# Altium project Controller PCB.PrjPcb
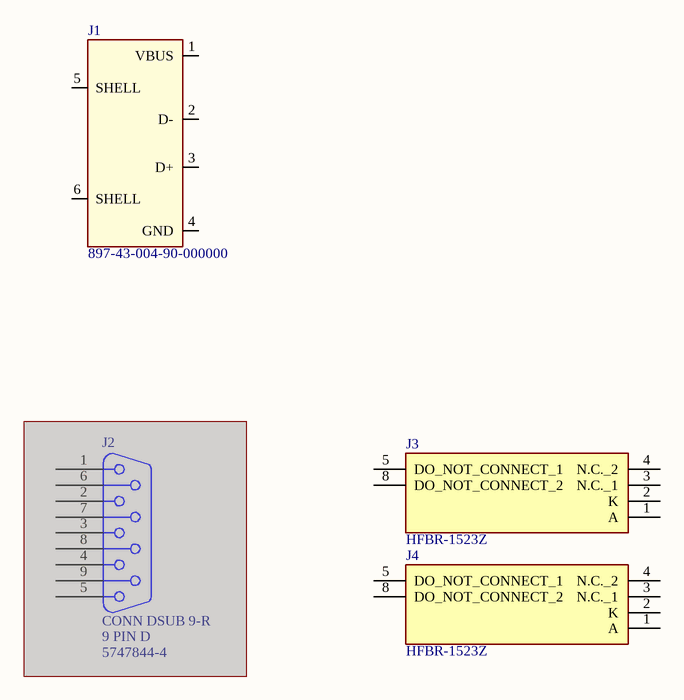
[diagram p0: Comms.SchDoc]
1 sheet, 4 parts. Net scope: global (net labels, ports and power ports of the same name join across sheets).
Board file: Controller PCB.PcbDoc

## Sheet Comms.SchDoc
size A; SheetNumber: 1; SheetTotal: 2

### Parts
J1  Manf P/N: 897-43-004-90-000000  [USB-R]  (hidden comment: USB-R)
J2  CONN DSUB 9-R  value 9 PIN D  Manf P/N: 5747844-4  [CONN9_5747844-4_TEC]  (masked out: inside a compile mask, not in the netlist)
J3  HFBR-1523Z  [HFBR1523Z]
J4  HFBR-1523Z  [HFBR1523Z]

### Nets

Not connected (* = marked no-connect by the designer): J1 1(VBUS) 2(D-) 3(D+) 4(GND) 5(SHELL) 6(SHELL); J3 1(A) 2(K) 3(N.C._1) 4(N.C._2) 5(DO_NOT_CONNECT_1) 8(DO_NOT_CONNECT_2); J4 1(A) 2(K) 3(N.C._1) 4(N.C._2) 5(DO_NOT_CONNECT_1) 8(DO_NOT_CONNECT_2)

### Library data of the parts
J1 = 1-00350: Conn USB 2.0 Type B RCP 4 POS 2.48mm Solder RA Thru-Hole 4 Terminal 1 Port Tube; Value: 4 PIN, USB; Manf: MILLMAX; Cat1: Other; Part Number: 1-00350; Type: Connector\Other; ComponentLink2URL: http://srsdata.corp.thinksrs.com:3838/ShinyParts/?Detail=100350; ComponentLink1URL: http://ventura.corp.thinksrs.com/datasheets/100350/datasheet.pdf; ComponentLink2Description: Info; ComponentLink1Description: datasheet; Cat2: Other; Cat3: Other
J2 = 1-00369: DB Female, Right Angle, .318"; Manf: TYCO; Cat1: Thru-hole; Cat2: D Connectors; Part Number: 1-00369; Type: Connector\Thru-hole\D Type\DB female; ComponentLink2URL: http://srsdata.corp.thinksrs.com:3838/ShinyParts/?Detail=100369; ComponentLink1URL: http://ventura.corp.thinksrs.com/datasheets/100369/datasheet.pdf; ComponentLink2Description: Info; ComponentLink1Description: datasheet; Cat3: DB female
J3 J4 = HFBR-1523Z: FIBER OPTIC TRANSMITTER, 0.04Mbps, THROUGH HOLE MOUNT, DIP; Manufacturer_Name: Avago Technologies; Geometry.Height: 7.62mm; Mouser Part Number: 630-HFBR-1523Z; Mouser Price/Stock: https://www.mouser.co.uk/ProductDetail/Broadcom-Avago/HFBR-1523Z?qs=jT9z6tsiFNlmblhCFyzz5A%3D%3D; Manufacturer_Part_Number: HFBR-1523Z; Datasheet Link: https://docs.broadcom.com/doc/AV02-1501EN